# EAGLE design pcb (EAGLE 7.0.0)
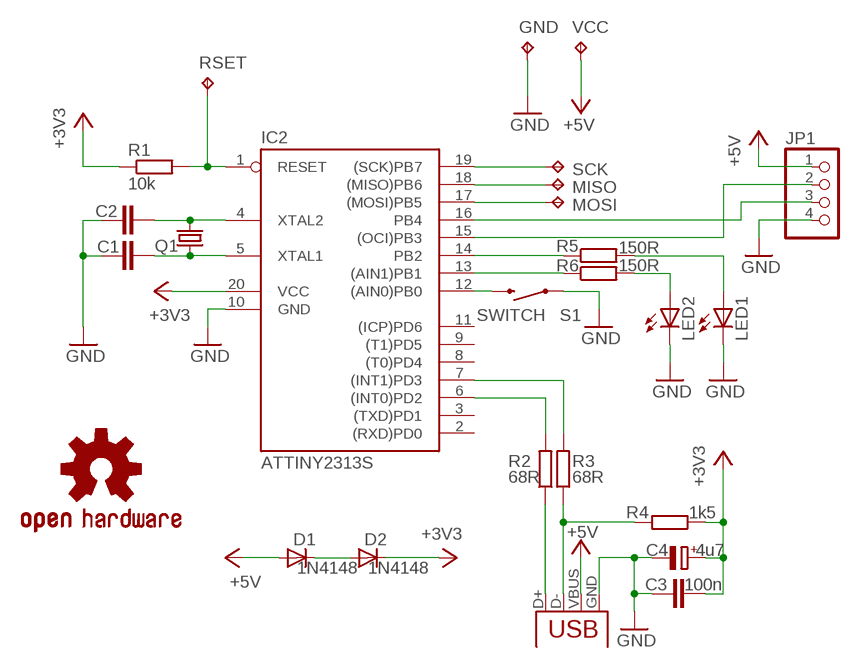
[diagram p0: schematic, sheet 1]

## Parts
C1  C-EUC1206  [C1206]
C2  C-EUC1206  [C1206]
C3  100n  C-EUC1206  [C1206]
C4  4u7  CPOL-EUB  [PANASONIC_B]
D1  1N4148  DIODESMA  [SMA-DIODE]
D2  1N4148  DIODESMA  [SMA-DIODE]
GND  TPB2,54  [B2,54]
IC2  ATTINY2313S  AT90S2313S  [SO20L]
JP1  PINHD-1X4_2.54  [1X04]
LED1  LED1206  [LED-1206]
LED2  LED1206  [LED-1206]
LOGO1  OSHW-LOGOM  [OSHW-LOGO-M]
MISO  TPB2,54  [B2,54]
MOSI  TPB2,54  [B2,54]
Q1  CRYSTALSMD  [HC49UP]
R1  10k  R-EU_R1206  [R1206]
R2  68R  R-EU_R1206  [R1206]
R3  68R  R-EU_R1206  [R1206]
R4  1k5  R-EU_R1206  [R1206]
R5  150R  R-EU_R1206  [R1206]
R6  150R  R-EU_R1206  [R1206]
RSET  TPB2,54  [B2,54]
S1  SWITCH  SWITCH-MOMENTARY-2-SMD-1101NE  [TACTILE-SWITCH-1101NE]
SCK  TPB2,54  [B2,54]
VCC  TPB2,54  [B2,54]
X1  USB-MICROB  [USB-MICROB]

## Nets
+3V3: C3.2 C4.+ D2.C IC2.20(VCC) R1.1 R4.1
+5V: D1.A JP1.1 VCC.TP X1.VBUS
GND: C1.1 C2.1 C3.1 C4.- GND.TP IC2.10(GND) JP1.4 LED1.C LED2.C S1.P$1 X1.GND
N$1: C1.2 IC2.5(XTAL1) Q1.1
N$2: C2.2 IC2.4(XTAL2) Q1.2
N$3: IC2.1(RESET) R1.2 RSET.TP
N$4: LED2.A R6.2
N$5: IC2.14(PB2) R5.1
N$6: IC2.13((AIN1)PB1) R6.1
N$7: LED1.A R5.2
N$8: R2.1 X1.D+
N$9: R3.1 R4.2 X1.D-
N$10: IC2.12((AIN0)PB0) S1.P$2
N$11: IC2.15((OCI)PB3) JP1.2
N$12: IC2.16(PB4) JP1.3
N$13: IC2.6((INT0)PD2) R2.2
N$14: IC2.7((INT1)PD3) R3.2
N$15: D1.C D2.A
N$16: IC2.19((SCK)PB7) SCK.TP
N$17: IC2.18((MISO)PB6) MISO.TP
N$18: IC2.17((MOSI)PB5) MOSI.TP
Unconnected: IC2.2((RXD)PD0) IC2.3((TXD)PD1) IC2.8((T0)PD4) IC2.9((T1)PD5) IC2.11((ICP)PD6)

## Library data of the parts
C1-C3 = rcl:C-EU: CAPACITOR, European symbol
C4 = rcl:CPOL-EU: POLARIZED CAPACITOR, European symbol
D1 D2 = SparkFun-DiscreteSemi:DIODE: Diode These are standard reverse protection diodes and small signal diodes. SMA package can handle up to about 1A. SOD-323 can handle about 200mA. What the SOD-323 package when ordering, there are some mfgs out there that are 5-pin packages.
GND MISO MOSI RSET SCK VCC = testpad:TP: Test pad
IC2 = atmel:AT90S2313: MICROCONTROLLER 2 Kbytes FLASH 128 bytes SRAM 128 bytes EEPROM UART; OC_FARNELL: unknown; OC_NEWARK: unknown
JP1 = pinhead-1:PINHD-1X4: PIN HEADER
LED1 LED2 = SparkFun-LED:LED: LEDs Standard schematic elements and footprints for 5mm, 3mm, 1206, and 0603 sized LEDs. 5mm - Spark Fun Electronics SKU : COM-00529 (and others)
LOGO1 = SparkFun-Aesthetics:OSHW-LOGO: Open Source Hardware Logo This logo indicates the piece of hardware it is found on incorporates a OSHW license and/or adheres to the definition of open source hardware found here: http://freedomdefined.org/OSHW
Q1 = SparkFun-FreqCtrl:CRYSTAL: Various standard crystals. Proven footprints. Spark Fun Electronics SKU : COM-00534
R1-R6 = rcl:R-EU_: RESISTOR, European symbol
S1 = SparkFun-Electromechanical:SWITCH-MOMENTARY-2: Various NO switches- pushbuttons, reed, etc
X1 = SparkFun:USB: USB Connectors USB-B-PTH is fully proven SKU : PRT-00139 USB-miniB is fully proven SKU : PRT-00587 USB-A-PCB is untested. USB-A-H is throughly reviewed, but untested. Spark Fun Electronics SKU : PRT-00437 USB-B-SMT is throughly reviewed, but untested. Needs silkscreen touching up. USB-A-S has not been used/tested USB-MB-H has not been used/tested

## Board
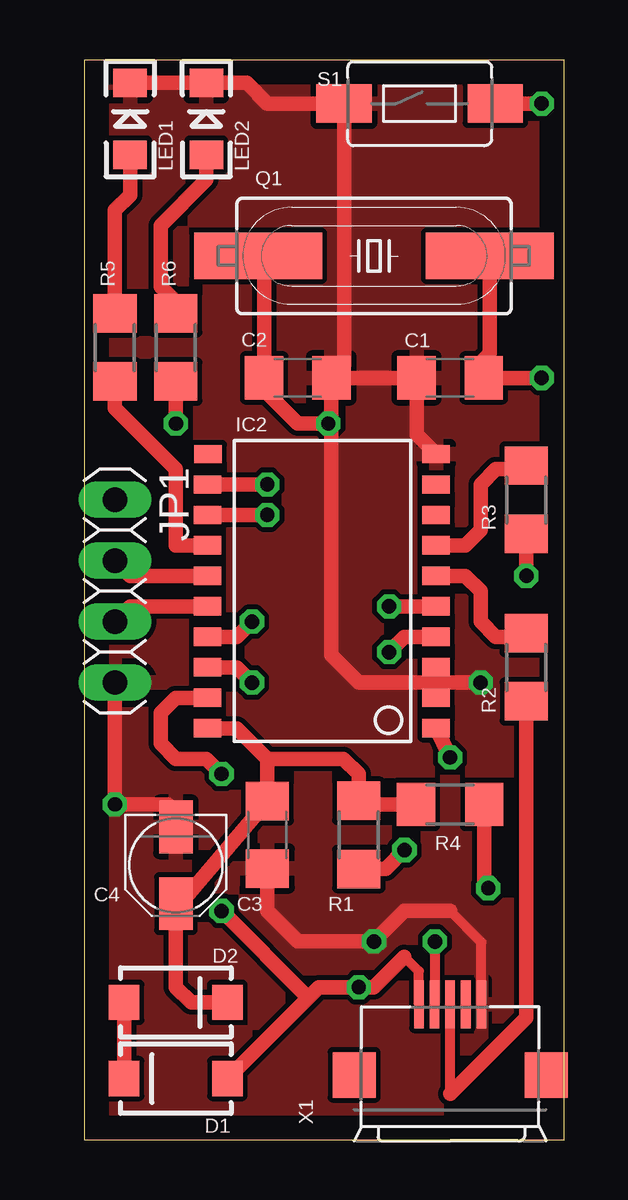
[diagram p1: board, top side]
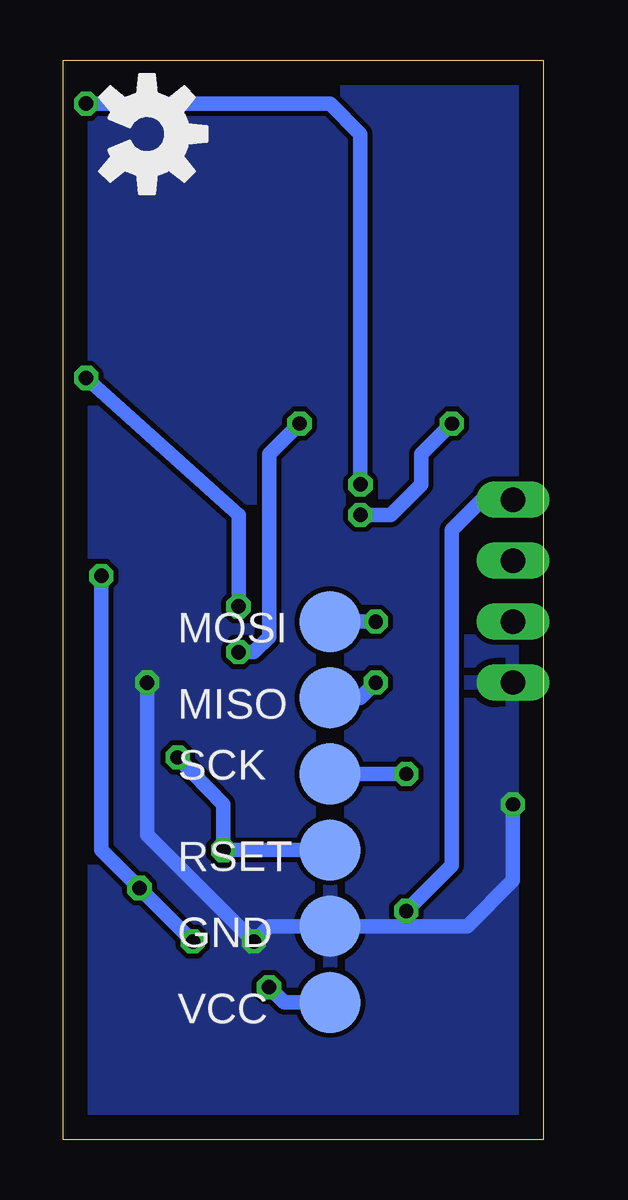
[diagram p2: board, bottom side, seen from below]

Size 20 x 45 mm. Coordinates in mm from the lower left corner, seen from the top.
Outline: 0,0 20,0 20,45 0,45 0,0
Copper layers (1*16): Top 0.035mm / dielectric 1.5mm / Bottom 0.035mm
Design rules "default": minimum track width 10mil, minimum drill 24mil, track to track 8mil, track to pad 8mil, pad to pad 8mil, via to via 8mil, smd to smd 8mil, copper to edge 40mil, drill to drill 8mil, minimum pad ring 10mil, minimum via ring 8mil, stop-mask expansion 4mil, vias tented up to drill 0mil, thermal gap 10mil

### Footprints (pad centres in the part's own frame; a part is rotated, then mirrored left to right if it is on the bottom)
C1206 = smd 1.6 x 1.8: 1 -1.4,0; 2 1.4,0
PANASONIC_B = smd 2.2 x 1.4: + 1.6,0; - -1.6,0
SMA-DIODE = smd 1.27 x 1.47: A -2.15,0; C 2.15,0
B2,54 = smd 2.54 x 2.54: TP 0,0
SO20L = smd 0.762 x 1.143: 1 -5.08,-5.131; 2 -3.81,-5.131; 3 -2.54,-5.131; 4 -1.27,-5.131; 5 0,-5.131; 6 1.27,-5.131; 7 2.54,-5.131; 8 3.81,-5.131; 9 5.08,-5.131; 10 6.35,-5.131; 11 6.35,4.369; 12 5.08,4.394; 13 3.81,4.394; 14 2.54,4.394; 15 1.27,4.394; 16 0,4.394; 17 -1.27,4.394; 18 -2.54,4.394; 19 -3.81,4.394; 20 -5.08,4.394
1X04 = drill 1.016 long: 1 -3.81,0; 2 -1.27,0; 3 1.27,0; 4 3.81,0
LED-1206 = smd 1.2 x 1.4: A -1.5,0; C 1.5,0
HC49UP = smd 5.334 x 1.93: 1 -4.826,0; 2 4.826,0
R1206 = smd 1.6 x 1.803: 1 -1.422,0; 2 1.422,0
TACTILE-SWITCH-1101NE = smd 2.3 x 1.6: P$1 -3.15,0; P$2 3.15,0
USB-MICROB = smd 0.4 x 2: D+ 0,3.1; D- -0.65,3.1; GND 1.3,3.1; ID 0.65,3.1; VBUS -1.3,3.1 | smd 1.8 x 1.9: GND@2 -4,0.15; GND@3 4,0.15

### Placement (x,y rotation side)
C1  15.24,31.75 0 top
C2  8.89,31.75 180 top
C3  7.62,12.7 90 top
C4  3.81,11.43 270 top
D1  3.81,2.54 180 top
D2  3.81,5.71 0 top
GND  8.89,8.89 0 bottom
IC2  9.53,22.23 90 top
JP1  1.27,22.86 270 top
LED1  1.91,42.55 90 top
LED2  5.08,42.55 90 top
LOGO1  16.51,41.91 270 bottom
MISO  8.89,18.41 0 bottom
MOSI  8.89,21.59 0 bottom
Q1  12.06,36.83 180 top
R1  11.43,12.7 270 top
R2  18.41,19.68 90 top
R3  18.41,26.67 90 top
R4  15.24,13.97 0 top
R5  1.27,33.02 90 top
R6  3.81,33.02 90 top
RSET  8.89,12.06 0 bottom
S1  13.97,43.18 0 top
SCK  8.89,15.24 0 bottom
VCC  8.89,5.71 0 bottom
X1  15.24,2.54 0 top

### Tracks (layer width: path | path; a pad name or v marks a point on that pad's centre or on a via)
+3V3
  Top 0.61: D2.C 4.45,5.71 3.81,6.35 C4.+ 3.98,9.83 C3.2 7.62,15.88 | IC2.20 6.35,17.14 7.62,15.88 | 7.62,15.88 10.79,15.88 11.43,15.24 R1.1 11.58,13.97 R4.1
+5V  (via drill 0.6)
  Top 0.406: X1.VBUS 13.94,7.01 13.34,7.62
  Top 0.61: 13.34,7.62 12.06,6.35 v11.43,6.35 9.77,6.35 9.33,5.91 | 9.33,5.91 D1.A | v5.71,9.53 9.33,5.91
  Bottom 0.61: v11.43,6.35 10.79,5.71 VCC.TP | JP1.1 2.54,26.67 3.81,25.4 3.81,11.43 v5.71,9.53
GND  (via drill 0.6)
  Top 0.406: X1.GND 16.54,8.22 15.24,9.53
  Top 0.61: IC2.10 13.84,29.39 C1.1 C2.1 | JP1.4 v1.27,13.97 3.48,13.97 C4.- | LED1.C LED2.C 6.75,44.05 7.62,43.18 S1.P$1 10.82,32.28 C2.1 | 15.24,9.53 13.34,9.53 v12.06,8.26 8.89,8.26 7.62,9.53 C3.1 | C2.1 10.29,20.19 11.43,19.05 v16.51,19.05
  Bottom 0.61: v1.27,13.97 1.27,10.79 3.17,8.89 GND.TP 11.43,8.89 v12.06,8.26 16.51,12.7 v16.51,19.05
  pour Bottom: -1.27,-1.27 21.59,-1.27 21.59,46.35 -1.27,46.35
  pour Top: -2.54,48.26 25.4,48.26 25.4,-5.08 -2.54,-5.08
N$1  (via drill 0.6)
  Top 0.61: C1.2 v19.05,31.75 | v12.7,22.23 IC2.5 | Q1.1 16.89,32.77 16.26,32.13
  Top 0.813: 16.26,32.13 C1.2
  Bottom 0.61: v19.05,31.75 12.7,26.04 v12.7,22.23
N$2  (via drill 0.6)
  Top 0.61: Q1.2 7.49,35.94 C2.2 7.62,31.62 7.62,31.11 8.89,29.84 v10.16,29.84 | IC2.4 13.34,20.95 v12.7,20.32
  Bottom 0.61: v12.7,20.32 12.06,20.32 11.43,20.95 11.43,28.57 v10.16,29.84
N$3  (via drill 0.6)
  Top 0.61: v15.24,15.93 IC2.1 | R1.2 12.55,11.28 v13.34,12.06
  Bottom 0.61: RSET.TP v13.34,12.06 13.34,13.97 v15.24,15.93
N$4
  Top 0.61: R6.2 3.81,34.92 3.17,35.56 3.17,38.1 5.08,40.01 LED2.A
N$5
  Top 0.61: IC2.14 3.81,24.77 3.81,27.94 1.27,30.48 R5.1
N$6  (via drill 0.6)
  Top 0.61: IC2.13 v7.62,26.04 | v3.81,29.84 R6.1
  Bottom 0.61: v7.62,26.04 6.35,26.04 5.08,27.3 5.08,28.57 v3.81,29.84
N$7
  Top 0.61: R5.2 1.27,38.73 1.91,39.37 LED1.A
N$8
  Top 0.406: 15.24,1.91 X1.D+
  Top 0.61: R2.1 18.41,5.08 15.24,1.91
N$9  (via drill 0.6)
  Top 0.406: v14.61,8.26 14.61,5.66 X1.D-
  Top 0.61: R3.1 v18.41,23.5 | R4.2 16.66,10.64 v16.83,10.48
  Bottom 0.61: v18.41,23.5 18.41,12.06 v16.83,10.48 16.51,10.16 v14.61,8.26
N$10  (via drill 0.6)
  Top 0.61: IC2.12 v7.62,27.3 | v19.05,43.18 S1.P$2
  Bottom 0.61: v7.62,27.3 7.62,41.91 8.89,43.18 v19.05,43.18
N$11
  Top 0.61: JP1.2 1.91,23.5 IC2.15
N$12
  Top 0.61: JP1.3 1.91,22.23 IC2.16
N$13
  Top 0.61: IC2.6 15.88,23.5 16.51,22.86 16.51,21.59 17.14,20.95 17.63,20.95 R2.2
N$14
  Top 0.61: IC2.7 15.88,24.77 16.51,25.4 16.51,27.3 17.14,27.94 18.26,27.94 R3.2
N$15
  Top 0.61: D1.C D2.A
N$16  (via drill 0.6)
  Top 0.61: v5.71,15.24 5.08,15.88 3.81,15.88 3.17,16.51 3.17,17.78 3.81,18.41 IC2.19
  Bottom 0.61: SCK.TP v5.71,15.24
N$17  (via drill 0.6)
  Top 0.61: IC2.18 6.35,19.68 v6.99,19.05
  Bottom 0.61: v6.99,19.05 7.62,18.41 MISO.TP
N$18  (via drill 0.6)
  Top 0.61: IC2.17 6.35,20.95 v6.99,21.59
  Bottom 0.61: v6.99,21.59 MOSI.TP